# EAGLE design Main (EAGLE 9.1.3)
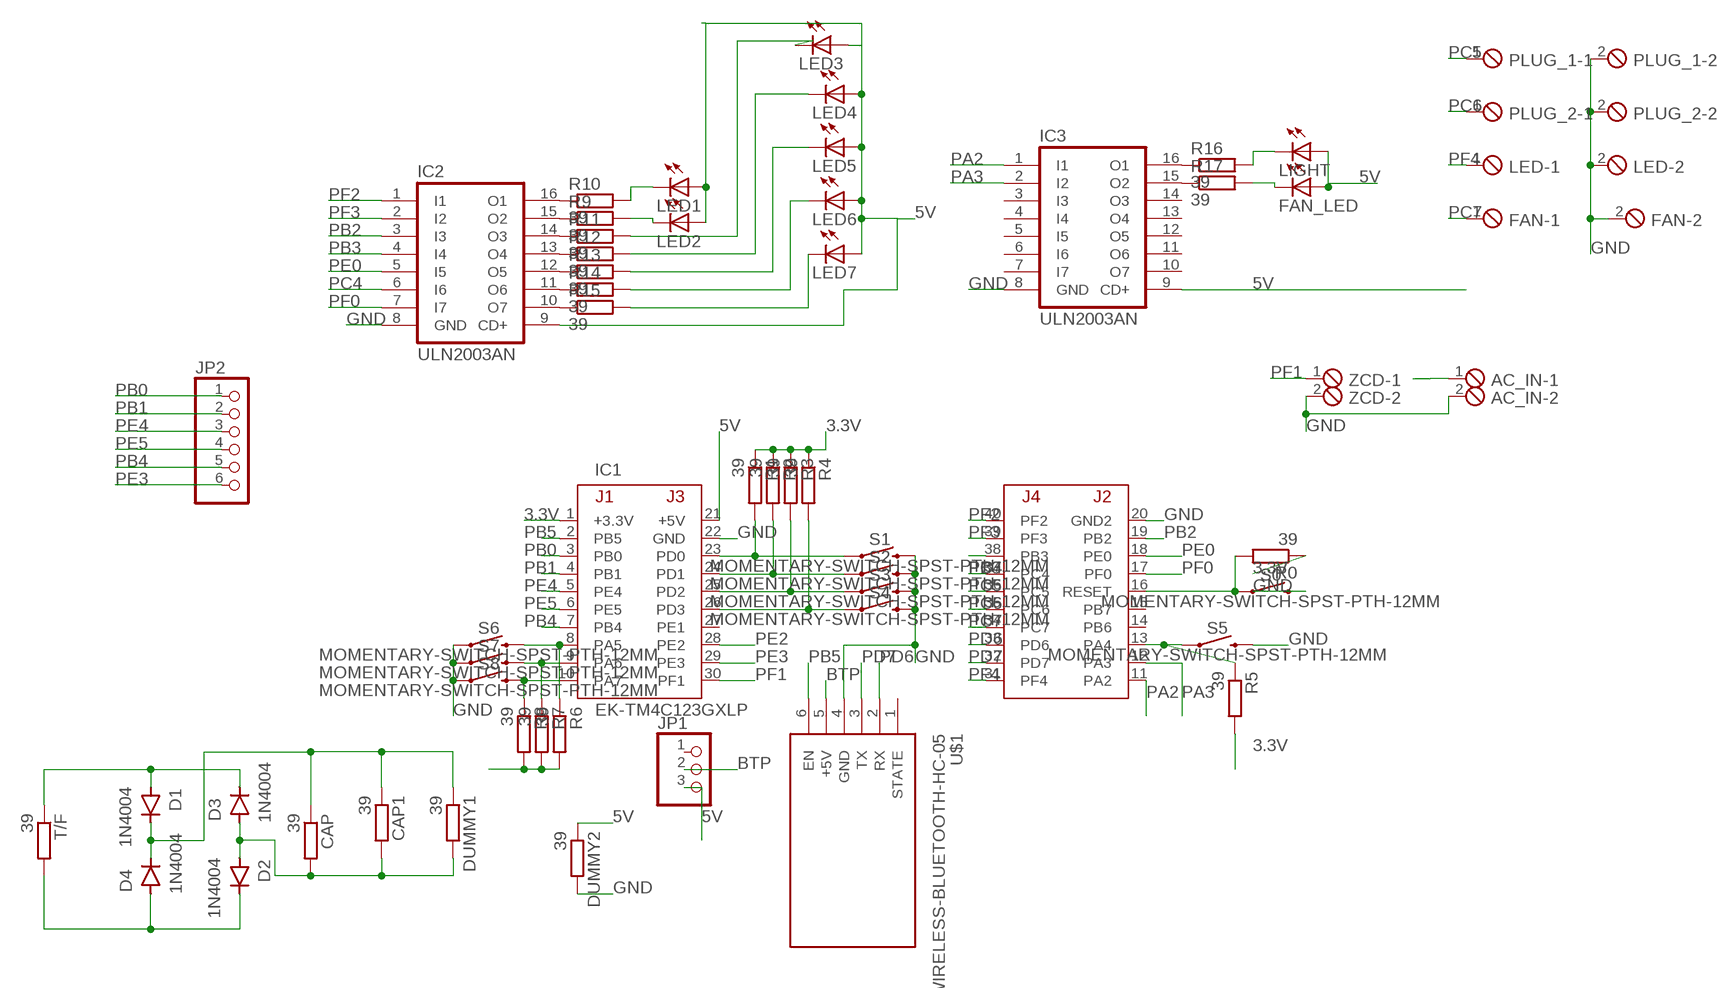
[diagram p0: schematic, sheet 1]

## Parts
AC_IN  MPT2  [2POL254]
CAP  39  R0204/7  [0204/7]
CAP1  39  R0204/7  [0204/7]
D1  1N4004  [DO-41]
D2  1N4004  [DO-41]
D3  1N4004  [DO-41]
D4  1N4004  [DO-41]
DUMMY1  39  R0204/7  [0204/7]
DUMMY2  39  R0204/7  [0204/7]
FAN  MPT2  [2POL254]
FAN_LED  LED3MM  [LED3MM]
IC1  EK-TM4C123GXLP  [TM4C123LAUNCHPAD]
IC2  ULN2003AN  [DIL16]
IC3  ULN2003AN  [DIL16]
JP1  PINHD-1X3CB  [1X03-CLEANBIG]
JP2  PINHD-1X6  [1X06]
LED  MPT2  [2POL254]
LED1  LED3MM  [LED3MM]
LED2  LED3MM  [LED3MM]
LED3  LED3MM  [LED3MM]
LED4  LED3MM  [LED3MM]
LED5  LED3MM  [LED3MM]
LED6  LED3MM  [LED3MM]
LED7  LED3MM  [LED3MM]
LIGHT  LED3MM  [LED3MM]
PLUG_1  MPT2  [2POL254]
PLUG_2  MPT2  [2POL254]
R0  39  R0204/7  [0204/7]
R1  39  R0204/7  [0204/7]
R2  39  R0204/7  [0204/7]
R3  39  R0204/7  [0204/7]
R4  39  R0204/7  [0204/7]
R5  39  R0204/7  [0204/7]
R6  39  R0204/7  [0204/7]
R7  39  R0204/7  [0204/7]
R8  39  R0204/7  [0204/7]
R9  39  R0204/7  [0204/7]
R10  39  R0204/7  [0204/7]
R11  39  R0204/7  [0204/7]
R12  39  R0204/7  [0204/7]
R13  39  R0204/7  [0204/7]
R14  39  R0204/7  [0204/7]
R15  39  R0204/7  [0204/7]
R16  39  R0204/7  [0204/7]
R17  39  R0204/7  [0204/7]
S0  MOMENTARY-SWITCH-SPST-PTH-12MM  [TACTILE_SWITCH_PTH_12MM]
S1  MOMENTARY-SWITCH-SPST-PTH-12MM  [TACTILE_SWITCH_PTH_12MM]
S2  MOMENTARY-SWITCH-SPST-PTH-12MM  [TACTILE_SWITCH_PTH_12MM]
S3  MOMENTARY-SWITCH-SPST-PTH-12MM  [TACTILE_SWITCH_PTH_12MM]
S4  MOMENTARY-SWITCH-SPST-PTH-12MM  [TACTILE_SWITCH_PTH_12MM]
S5  MOMENTARY-SWITCH-SPST-PTH-12MM  [TACTILE_SWITCH_PTH_12MM]
S6  MOMENTARY-SWITCH-SPST-PTH-12MM  [TACTILE_SWITCH_PTH_12MM]
S7  MOMENTARY-SWITCH-SPST-PTH-12MM  [TACTILE_SWITCH_PTH_12MM]
S8  MOMENTARY-SWITCH-SPST-PTH-12MM  [TACTILE_SWITCH_PTH_12MM]
T/F  39  R0204/7  [0204/7]
U$1  WIRELESS-BLUETOOTH-HC-05  [WIRELESS-BLUETOOTH-HC-05]
ZCD  MPT2  [2POL254]

## Nets
3.3V: IC1.1(+3.3V) R0.1 R1.1 R2.1 R3.1 R4.1 R5.2 R6.2 R7.2 R8.2
5V: DUMMY2.1 FAN_LED.A IC1.21(+5V) IC2.9(CD+) IC3.9(CD+) JP1.3 LED1.A LED2.A LED3.A LED4.A LED5.A LED6.A LED7.A LIGHT.A
BTP: JP1.2 U$1.5(+5V)
GND: AC_IN.2 DUMMY2.2 FAN.2 IC1.20(GND2) IC1.22(GND) IC2.8(GND) IC3.8(GND) LED.2 PLUG_1.2 PLUG_2.2 S0.3 S1.3 S2.3 S3.3 S4.3 S5.3 S6.1 S7.1 S8.1 U$1.4(GND) ZCD.2
N$1: IC1.23(PD0) R1.2 S1.1
N$2: IC1.24(PD1) R2.2 S2.1
N$3: IC1.25(PD2) R3.2 S3.1
N$4: IC1.26(PD3) R4.2 S4.1
N$5: IC1.13(PA4) R5.1 S5.1
N$6: IC1.8(PA5) R6.1 S6.3
N$7: IC1.16(RESET) R0.2 S0.1
N$8: IC1.9(PA6) R7.1 S7.3
N$9: IC1.10(PA7) R8.1 S8.3
N$10: IC2.15(O2) R9.1
N$11: IC2.16(O1) R10.1
N$12: IC2.14(O3) R11.1
N$13: IC2.13(O4) R12.1
N$14: D1.A D3.C T/F.1
N$15: IC2.12(O5) R13.1
N$16: IC2.11(O6) R14.1
N$17: IC2.10(O7) R15.1
N$18: IC3.16(O1) R16.1
N$19: LED1.K(C) R10.2
N$20: LED2.K(C) R9.2
N$21: LED3.K(C) R11.2
N$22: LED4.K(C) R12.2
N$23: LED5.K(C) R13.2
N$24: LED6.K(C) R14.2
N$25: LED7.K(C) R15.2
N$26: IC3.15(O2) R17.1
N$28: CAP1.2 CAP.2 D2.A D3.A DUMMY1.2
N$29: CAP1.1 CAP.1 D1.C D4.C DUMMY1.1
N$30: D2.C D4.A T/F.2
N$32: LIGHT.K(C) R16.2
N$33: FAN_LED.K(C) R17.2
PA2: IC1.11(PA2) IC3.1(I1)
PA3: IC1.12(PA3) IC3.2(I2)
PB0: IC1.3(PB0) JP2.1
PB1: IC1.4(PB1) JP2.2
PB2: IC1.19(PB2) IC2.3(I3)
PB3: IC1.38(PB3) IC2.4(I4)
PB4: IC1.7(PB4) JP2.5
PB5: IC1.2(PB5) U$1.6(EN)
PC4: IC1.37(PC4) IC2.6(I6)
PC5: IC1.36(PC5) PLUG_1.1
PC6: IC1.35(PC6) PLUG_2.1
PC7: FAN.1 IC1.34(PC7)
PD6: IC1.33(PD6) U$1.2(RX)
PD7: IC1.32(PD7) U$1.3(TX)
PE0: IC1.18(PE0) IC2.5(I5)
PE2: AC_IN.1 IC1.28(PE2)
PE3: IC1.29(PE3) JP2.6
PE4: IC1.5(PE4) JP2.3
PE5: IC1.6(PE5) JP2.4
PF0: IC1.17(PF0) IC2.7(I7)
PF1: IC1.30(PF1) ZCD.1
PF2: IC1.40(PF2) IC2.1(I1)
PF3: IC1.39(PF3) IC2.2(I2)
PF4: IC1.31(PF4) LED.1
Unconnected: IC1.14(PB6) IC1.15(PB7) IC1.27(PE1) IC3.3(I3) IC3.4(I4) IC3.5(I5) IC3.6(I6) IC3.7(I7) IC3.10(O7) IC3.11(O6) IC3.12(O5) IC3.13(O4) IC3.14(O3) JP1.1 U$1.1(STATE)

## Library data of the parts
AC_IN FAN LED PLUG_1 PLUG_2 ZCD = con-phoenix-254:MPT2: PHOENIX CONNECTOR; OC_FARNELL: unknown; OC_NEWARK: unknown
CAP CAP1 DUMMY1 DUMMY2 R0 R1-R17 T/F = eagle-ltspice:R: RESISTOR, European symbol; SPICEMODEL: NONE; SPICEPREFIX: R
D1-D4 = Diodes:1N4004: DIODE GEN PURP 400V 1A DO41 Manufacturer's datasheet <https://www.mccsemi.com/pdf/Products/1N4001-1N4007(DO-41).pdf>; CREATED_BY: PCBLayout.com; DIGIKEY_PART_NUMBER: 1N4004MSCT-ND; MANUFACTURER: Micro Commercial Co; MPN: 1N4004; PACKAGE: DO-41
FAN_LED LED1-LED7 LIGHT = adafruit:LED: LED OSRAM: - CHIPLED LG R971, LG N971, LY N971, LG Q971, LY Q971, LO R971, LY R971 LH N974, LH R974 LS Q976, LO Q976, LY Q976 LO Q996 - Hyper CHIPLED LW Q18S LB Q993, LB Q99A, LB R99A - SideLED LS A670, LO A670, LY A670, LG A670, LP A670 LB A673, LV A673, LT A673, LW A673 LH A674 LY A675 LS A676, LA A676, LO A676, LY A676, LW A676 LS A679, LY A679, LG A679 - Hyper Micro SIDELED® LS Y876, LA Y876, LO Y876, LY Y876 LT Y87S - SmartLED LW L88C, LW L88S LB L89C, LB L89S, LG L890 LS L89K, LO L89K, LY L89K LS L896, LA L896, LO L896, LY L896 - TOPLED LS T670, LO T670, LY T670, LG T670, LP T670 LSG T670, LSP T670, LSY T670, LOP T670, LYG T670 LG T671, LOG T671, LSG T671 LB T673, LV T673, LT T673, LW T673 LH T674 LS T676, LA T676, LO T676, LY T676, LB T676, LH T676, LSB T676, LW T676 LB T67C, LV T67C, LT T67C, LS T67K, LO T67K, LY T67K, LW E67C LS E67B, LA E67B, LO E67B, LY E67B, LB E67C, LV E67C, LT E67C LW T67C LS T679, LY T679, LG T679 LS T770, LO T770, LY T770, LG T770, LP T770 LB T773, LV T773, LT T773, LW T773 LH T774 LS E675, LA E675, LY E675, LS T675 LS T776, LA T776, LO T776, LY T776, LB T776 LHGB T686 LT T68C, LB T68C - Hyper Mini TOPLED® LB M676 - Mini TOPLED Santana® LG M470 LS M47K, LO M47K, LY M47K Source: http://www.osram.convergy.de/
IC1 = EK-TM4C123GXL:EK-TM4C123GXL: Texas Instruments TM4C123 LaunchPad EK-TM4C123GXL www.ti.com/tool/ek-tm4c123gxl; AVAILABILITY: Unavailable; DESCRIPTION: TM4C123G LaunchPad™ Tiva™ C ARM® Cortex®-M4F MCU 32-Bit Embedded Evaluation Board; MF: Texas Instruments; MP: EK-TM4C123GXL; PACKAGE: None; PRICE: None
IC2 IC3 = uln-udn:ULN2003A: DRIVER ARRAY
JP1 = adafruit:PINHD-1X3: PIN HEADER
JP2 = adafruit:PINHD-1X6: PIN HEADER
S0 S1-S8 = SparkFun-Switches:MOMENTARY-SWITCH-SPST: Momentary Switch (Pushbutton) - SPST Normally-open (NO) SPST momentary switches (buttons, pushbuttons). Variants PTH-12MM - 12mm square, through-hole Momentary Pushbutton Switch - 12mm Square <https://www.sparkfun.com/products/9190> (COM-09190) PTH-6.0MM, PTH-6.0MM-KIT - 6.0mm square, through-hole Mini Pushbutton Switch <https://www.sparkfun.com/products/97> (COM-00097) KIT package intended for soldering kit's - only one side of pads' copper is exposed. PTH-RIGHT-ANGLE-KIT - Right-angle, through-hole Right Angle Tactile Button <https://www.sparkfun.com/products/10791> - Used on SparkFun BigTime Watch Kit <https://www.sparkfun.com/products/11734> SMD-12MM - 12mm square, surface-mount Tactile Button - SMD (12mm) <https://www.sparkfun.com/products/12993> (COM-12993) Used on SparkFun PicoBoard <https://www.sparkfun.com/products/11888> SMD-4.5MM - 4.5mm Square Trackball Switch Used on SparkFun Blackberry Trackballer Breakout <https://www.sparkfun.com/products/13169> SMD-4.6MMX2.8MM - 4.60mm x 2.80mm, surface mount Used on SparkFun SAMD21 Mini Breakout <https://www.sparkfun.com/products/13664> SMD-5.2MM, SMD-5.2-REDUNDANT - 5.2mm square, surface-mount Mini Pushbutton Switch - SMD <https://www.sparkfun.com/products/8720> (COM-08720) Used on Arduino Pro Mini <https://www.sparkfun.com/products/11114> REDUNDANT package connects both switch circuits together SMD-6.0X3.5MM - 6.0 x 3.5mm, surface mount Momentary Reset Switch SMD <https://www.sparkfun.com/products/8229> (COM-08229) SMD-6.2MM-TALL - 6.2mm square, surface mount Tactile Button - SMD (6mm) <https://www.sparkfun.com/products/12992> Used on SparkFun Digital Sandbox <https://www.sparkfun.com/products/12651> SMD-RIGHT-ANGLE - Right-angle, surface mount Used on SparkFun Block for Intel® Edison - Arduino <https://www.sparkfun.com/products/13036>; PROD_ID: SWCH-09185; SF_SKU: COM-09190
U$1 = diy-modules:WIRELESS-BLUETOOTH-HC-05: Bluetooth Transceiver Module based on HC-05 board Tutorial is available here: https://arduino-info.wikispaces.com/BlueTooth-HC05-HC06-Modules-How-To Click here to find device on ebay.com <http://www.ebay.com/sch/hc-05+module+rs232>

## Board
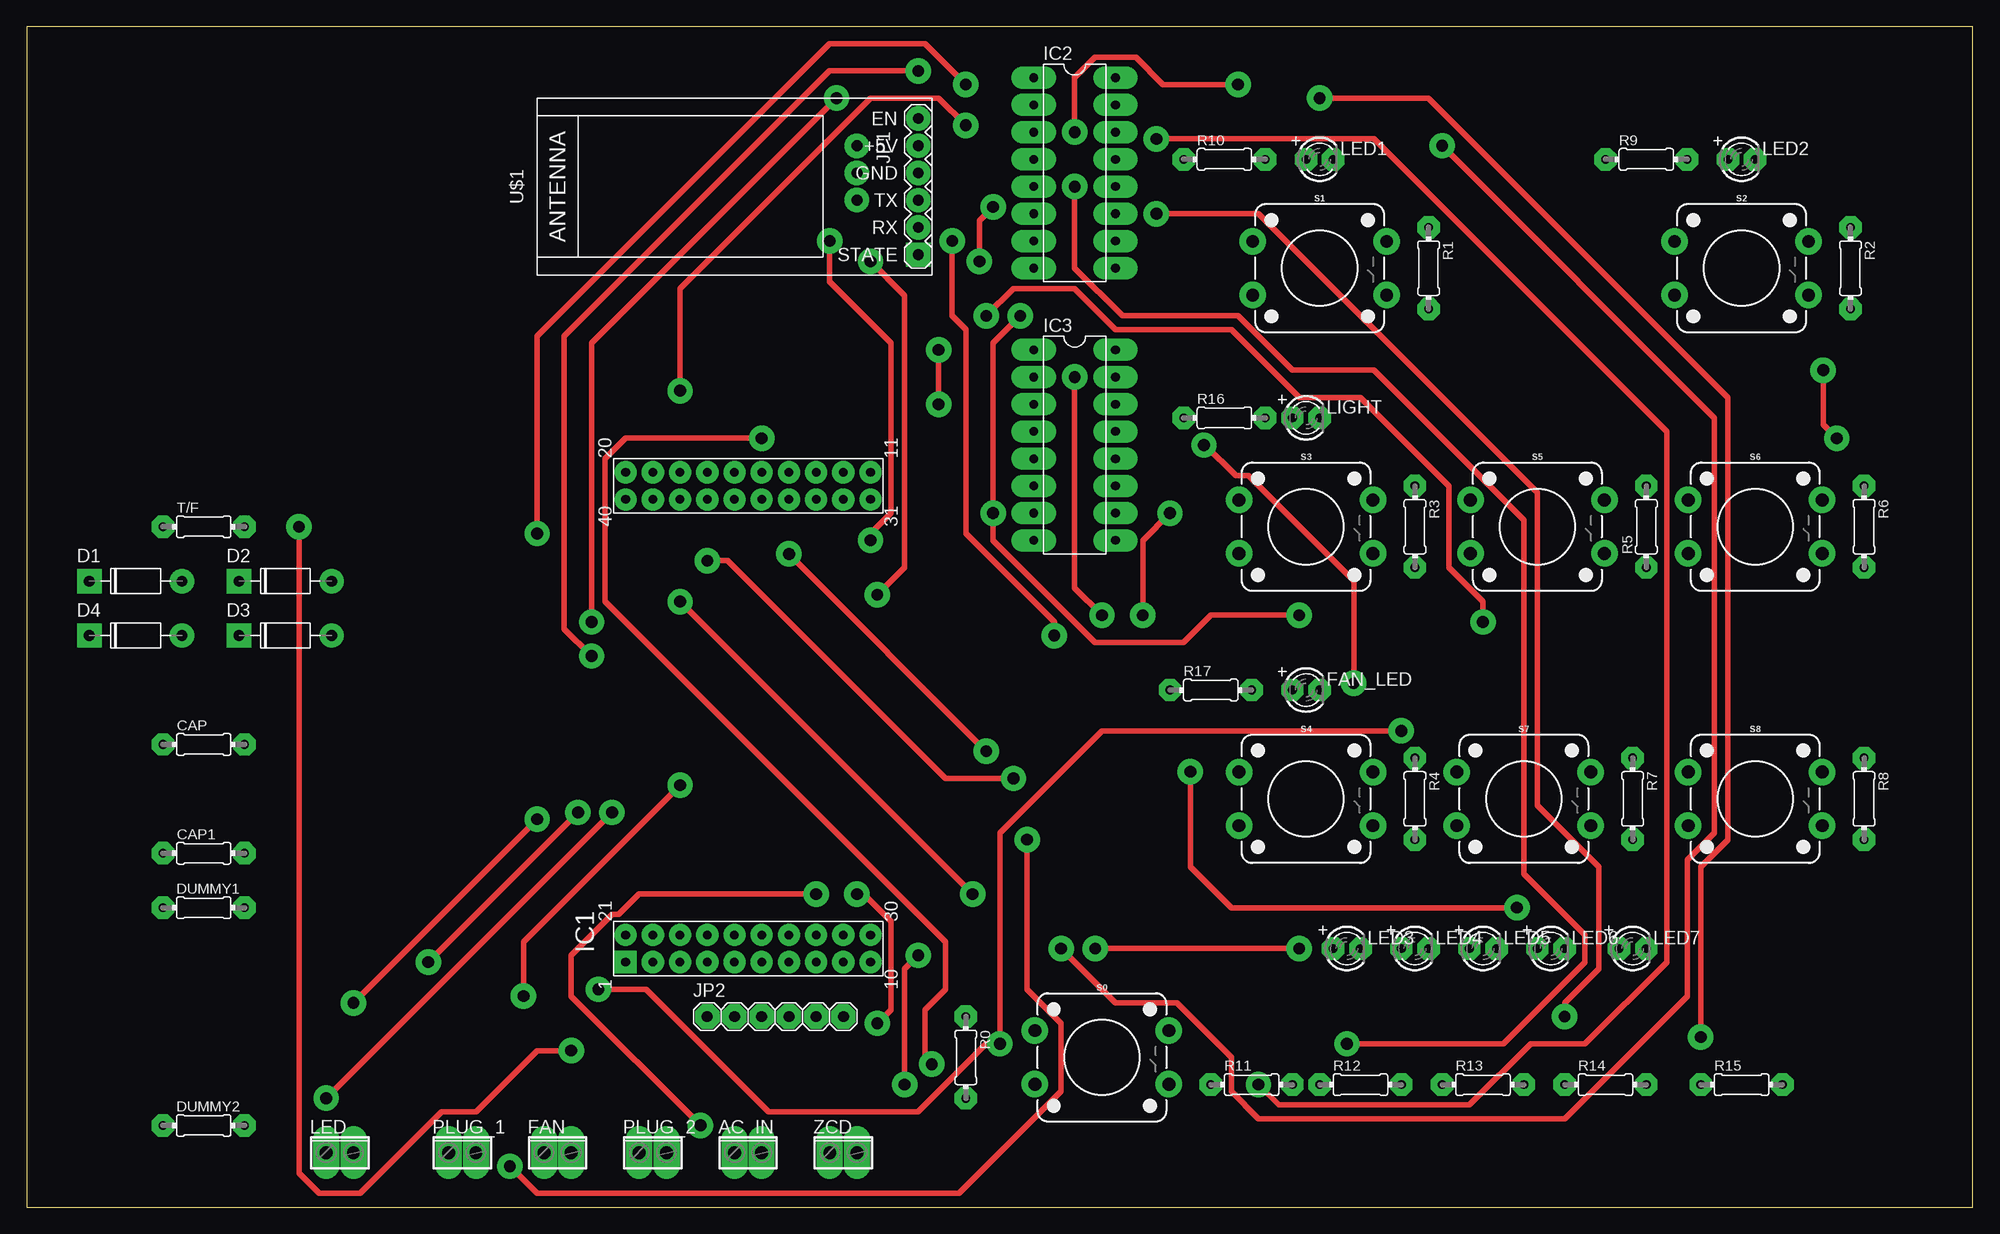
[diagram p1: board, top side]
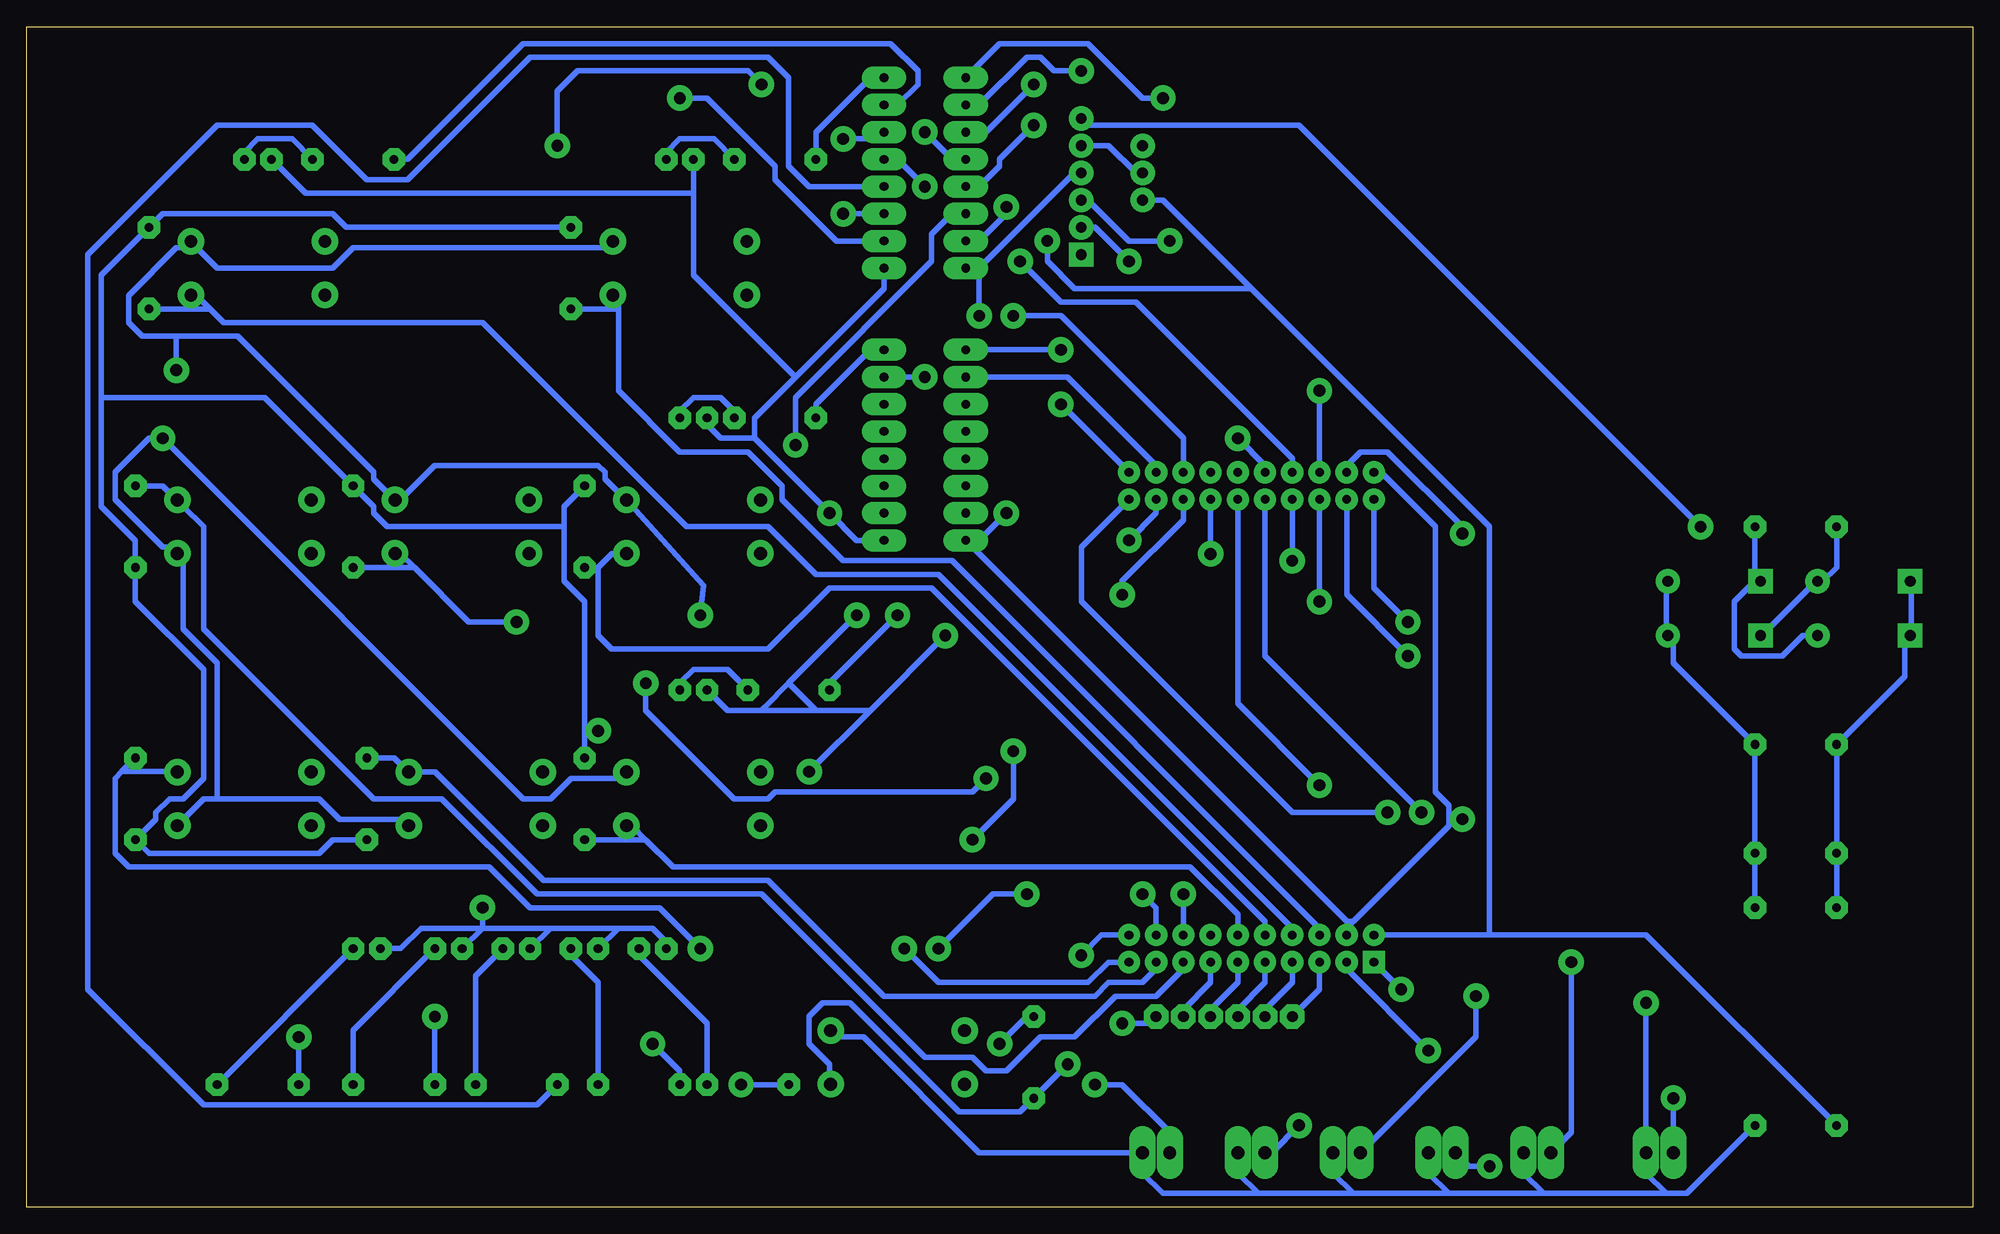
[diagram p2: board, bottom side, seen from below]

Size 181.59 x 110.16 mm. Coordinates in mm from the lower left corner, seen from the top.
Outline: 0,0 181.59,0 181.59,110.16 0,110.16 0,0
Copper layers (1*16): Top 0.035mm / dielectric 1.5mm / Bottom 0.035mm
Design rules "default *": minimum track width 20mil, minimum drill 1.1mm, track to track 20mil, track to pad 20mil, pad to pad 20mil, via to via 20mil, smd to smd 6mil, copper to edge 40mil, drill to drill 6mil, minimum pad ring 25mil, minimum via ring 25mil, stop-mask expansion 4mil, vias tented up to drill 0mil, thermal gap 10mil

### Footprints (pad centres in the part's own frame; a part is rotated, then mirrored left to right if it is on the bottom)
2POL254 = drill 1.2 long: 1 -1.27,0; 2 1.27,0
0204/7 = drill 0.813 octagon: 1 -3.81,0; 2 3.81,0
DO-41 = drill 1: A 4.325,0 | drill 1 square: C -4.325,0
LED3MM = drill 0.813 pad 1.676 octagon: A -1.27,0; K 1.27,0
TM4C123LAUNCHPAD = drill 0.8 square: 1 -22.86,12.7 | drill 0.8: 2 -22.86,10.16; 3 -22.86,7.62; 4 -22.86,5.08; 5 -22.86,2.54; 6 -22.86,0; 7 -22.86,-2.54; 8 -22.86,-5.08; 9 -22.86,-7.62; 10 -22.86,-10.16; 11 22.86,-10.16; 12 22.86,-7.62; 13 22.86,-5.08; 14 22.86,-2.54; 15 22.86,0; 16 22.86,2.54; 17 22.86,5.08; 18 22.86,7.62; 19 22.86,10.16; 20 22.86,12.7; 21 -20.32,12.7; 22 -20.32,10.16; 23 -20.32,7.62; 24 -20.32,5.08; 25 -20.32,2.54; 26 -20.32,0; 27 -20.32,-2.54; 28 -20.32,-5.08; 29 -20.32,-7.62; 30 -20.32,-10.16; 31 20.32,-10.16; 32 20.32,-7.62; 33 20.32,-5.08; 34 20.32,-2.54; 35 20.32,0; 36 20.32,2.54; 37 20.32,5.08; 38 20.32,7.62; 39 20.32,10.16; 40 20.32,12.7
DIL16 = drill 0.813 long: 1 -8.89,-3.81; 2 -6.35,-3.81; 3 -3.81,-3.81; 4 -1.27,-3.81; 5 1.27,-3.81; 6 3.81,-3.81; 7 6.35,-3.81; 8 8.89,-3.81; 9 8.89,3.81; 10 6.35,3.81; 11 3.81,3.81; 12 1.27,3.81; 13 -1.27,3.81; 14 -3.81,3.81; 15 -6.35,3.81; 16 -8.89,3.81
1X03-CLEANBIG = drill 1.016 pad 1.676: 1 -2.54,0; 2 0,0; 3 2.54,0
1X06 = drill 1.016 octagon: 1 -6.35,0; 2 -3.81,0; 3 -1.27,0; 4 1.27,0; 5 3.81,0; 6 6.35,0
TACTILE_SWITCH_PTH_12MM = drill 1.2 pad 2.159: 1 6.25,-2.5; 2 -6.25,-2.5; 3 6.25,2.5; 4 -6.25,2.5
WIRELESS-BLUETOOTH-HC-05 = drill 1 square: 1 -6.35,-17.145 | drill 1: 2 -3.81,-17.145; 3 -1.27,-17.145; 4 1.27,-17.145; 5 3.81,-17.145; 6 6.35,-17.145

### Placement (x,y rotation side)
AC_IN  67.31,5.08 0 top
CAP  16.51,43.18 0 top
CAP1  16.51,33.02 0 top
D1  10.16,58.42 0 top
D2  24.13,58.42 0 top
D3  24.13,53.34 0 top
D4  10.16,53.34 0 top
DUMMY1  16.51,27.94 0 top
DUMMY2  16.51,7.62 0 top
FAN  49.53,5.08 0 top
FAN_LED  119.38,48.26 0 top
IC1  68.58,45.72 90 top
IC2  97.79,96.52 270 top
IC3  97.79,71.12 270 top
JP1  77.47,96.52 270 top
JP2  69.85,17.78 0 top
LED  29.21,5.08 0 top
LED1  120.65,97.79 0 top
LED2  160.02,97.79 0 top
LED3  123.19,24.13 0 top
LED4  129.54,24.13 0 top
LED5  135.89,24.13 0 top
LED6  142.24,24.13 0 top
LED7  149.86,24.13 0 top
LIGHT  119.38,73.66 0 top
PLUG_1  40.64,5.08 0 top
PLUG_2  58.42,5.08 0 top
R0  87.63,13.97 270 top
R1  130.81,87.63 270 top
R2  170.18,87.63 270 top
R3  129.54,63.5 270 top
R4  129.54,38.1 270 top
R5  151.13,63.5 90 top
R6  171.45,63.5 270 top
R7  149.86,38.1 270 top
R8  171.45,38.1 270 top
R9  151.13,97.79 0 top
R10  111.76,97.79 0 top
R11  114.3,11.43 0 top
R12  124.46,11.43 0 top
R13  135.89,11.43 0 top
R14  147.32,11.43 0 top
R15  160.02,11.43 0 top
R16  111.76,73.66 0 top
R17  110.49,48.26 0 top
S0  100.33,13.97 0 top
S1  120.65,87.63 0 top
S2  160.02,87.63 0 top
S3  119.38,63.5 0 top
S4  119.38,38.1 0 top
S5  140.97,63.5 0 top
S6  161.29,63.5 0 top
S7  139.7,38.1 0 top
S8  161.29,38.1 0 top
T/F  16.51,63.5 0 top
U$1  66.04,95.25 90 top
ZCD  76.2,5.08 0 top

### Tracks (layer width: path | path; a pad name or v marks a point on that pad's centre or on a via)
3.3V  (via drill 1.1)
  Top 0.508: v53.34,20.32 57.78,20.32 69.22,8.89 83.19,8.89 89.53,15.24 v90.81,15.24 90.81,34.92 100.33,44.45 v128.27,44.45
  Bottom 0.508: R7.2 153.03,34.29 154.31,33.02 170.18,33.02 R8.2 169.55,36.2 169.55,36.83 168.28,38.1 167,38.1 165.1,40 165.1,50.16 171.45,56.52 R6.2 171.45,62.23 174.62,65.41 174.62,71.75 174.62,75.56 | R1.1 151.76,91.44 153.03,92.71 168.91,92.71 R2.1 174.62,87 174.62,75.56 | v53.34,20.32 IC1.1 | v90.81,15.24 88.27,17.78 R0.1 | 129.54,44.45 129.54,56.52 131.44,58.42 131.44,63.5 | 129.54,44.45 R4.1 | 131.44,63.5 131.44,65.41 R3.1 | 131.44,63.5 147.95,63.5 149.22,64.77 149.22,65.41 R5.2 159.38,75.56 174.62,75.56 | 129.54,44.45 v128.27,44.45
5V  (via drill 1.1)
  Top 0.508: v104.14,55.24 104.14,62.23 v106.68,64.77 | v139.06,27.94 112.39,27.94 108.59,31.75 v108.59,40.64 | v95.89,53.34 95.89,54.61 87.63,62.86 87.63,81.91 86.36,83.19 v86.36,90.17
  Bottom 0.508: LED3.A 121.92,24.77 123.19,26.03 126.37,26.03 | LED4.A 126.37,26.03 | 132.72,26.03 LED5.A | 126.37,26.03 132.72,26.03 | 139.06,26.03 LED6.A | 132.72,26.03 139.06,26.03 | LED7.A 146.69,24.13 144.78,26.03 139.06,26.03 | IC3.9 104.14,62.23 v106.68,64.77 113.66,71.75 | 113.66,71.75 116.84,71.75 118.11,73.02 LIGHT.A | FAN_LED.A 116.2,46.35 114.94,46.35 | 102.87,46.35 114.94,46.35 | v104.14,55.24 110.49,48.89 | 110.49,48.89 112.71,46.67 | 112.71,46.67 113.03,46.35 114.94,46.35 | IC2.9 101.6,85.72 109.86,77.47 | 109.86,77.47 113.66,73.66 113.66,71.75 | 119.38,94.61 119.38,87 109.86,77.47 | 119.38,94.61 LED1.A | LED2.A 155.57,94.61 119.38,94.61 | v139.06,27.94 139.06,26.03 | 102.87,46.35 v108.59,40.64 | 45.09,25.4 30.48,25.4 DUMMY2.1 | 45.09,25.4 IC1.21 | JP1.3 75.56,93.98 67.31,85.72 | 67.31,85.72 45.09,63.5 45.09,25.4 | 110.49,48.89 107.95,46.35 102.87,46.35 | v95.89,53.34 102.87,46.35 | v86.36,90.17 86.36,88.27 83.82,85.72 67.31,85.72 | 112.71,46.67
BTP
  Bottom 0.508: U$1.5 80.64,99.06 78.11,96.52 JP1.2
GND  (via drill 1.1)
  Top 0.508: v92.71,83.19 90.17,80.64 v90.17,64.77 90.17,62.23 99.69,52.7 107.95,52.7 110.49,55.24 v118.75,55.24 | v47.62,36.2 v30.48,19.05 | v167.64,78.11 167.64,73.02 v168.91,71.75
  Bottom 0.508: S1.3 127,89.53 151.13,89.53 153.03,87.63 163.83,87.63 165.74,89.53 S2.3 166.37,89.53 167.64,89.53 172.08,85.09 172.08,82.55 170.81,81.28 167.64,81.28 | 167.64,81.28 161.93,81.28 149.22,68.58 149.22,67.95 147.32,66.04 S5.3 146.69,66.04 143.51,69.22 128.27,69.22 127.63,68.58 127.63,67.95 125.73,66.04 S3.3 118.45,58.02 v118.75,55.24 | 163.83,38.1 165.1,38.1 167,36.2 S8.1 | 163.83,38.1 154.31,38.1 152.4,36.2 146.05,36.2 S7.1 | S4.3 125.73,40 130.81,40 132.72,38.1 135.25,38.1 v168.91,71.75 170.18,71.75 173.36,68.58 173.36,66.04 168.91,61.59 167.64,61.59 S6.1 167,60.96 167,53.98 163.83,50.8 163.83,38.1 | v167.64,78.11 167.64,81.28 | DUMMY2.2 26.67,1.27 28.58,1.27 | 28.58,1.27 30.48,3.17 LED.2 v30.48,19.05 | PLUG_1.2 41.91,3.17 40.01,1.27 | 28.58,1.27 40.01,1.27 | FAN.2 50.8,3.17 48.89,1.27 | 40.01,1.27 48.89,1.27 | PLUG_2.2 59.69,3.17 57.78,1.27 | 48.89,1.27 57.78,1.27 | AC_IN.2 68.58,3.17 66.67,1.27 | 57.78,1.27 66.67,1.27 | 66.67,1.27 75.56,1.27 77.47,3.17 ZCD.2 92.71,5.08 103.5,15.88 106.05,15.88 S0.3 | 92.71,87.63 83.82,96.52 U$1.4 | IC1.20 55.25,68.58 50.16,63.5 50.16,38.73 48.89,37.46 48.89,36.2 | 48.89,36.2 48.89,35.56 57.78,26.67 | 57.78,26.67 58.42,26.03 IC1.22 | 93.34,61.59 58.42,26.67 57.78,26.67 | v92.71,83.19 92.71,87.63 | 93.34,61.59 v90.17,64.77 | 92.71,87.63 IC2.8 | 93.34,61.59 IC3.8 | 48.89,36.2 v47.62,36.2
N$1
  Bottom 0.508: IC1.23 60.96,26.03 95.25,60.32 105.41,60.32 111.12,66.04 111.12,67.31 114.3,70.48 120.65,70.48 126.37,76.2 126.37,83.82 | 126.37,83.82 126.37,85.09 S1.1 | 126.37,83.82 R1.2
N$2
  Bottom 0.508: IC1.24 63.5,26.03 96.52,59.05 107.95,59.05 112.39,63.5 120.02,63.5 139.06,82.55 163.19,82.55 164.47,83.82 | 164.47,83.82 165.74,85.09 S2.1 | 164.47,83.82 R2.2
N$3
  Bottom 0.508: IC1.25 66.04,26.67 97.16,57.78 106.68,57.78 112.39,52.07 127,52.07 128.27,53.34 128.27,59.69 | 125.09,60.96 S3.1 126.96,61 128.27,59.69 | 128.27,59.69 R3.2
N$4
  Bottom 0.508: IC1.26 68.58,27.3 73.03,31.75 121.28,31.75 123.83,34.29 | 123.83,34.29 125.09,35.56 S4.1 | 123.83,34.29 R4.2
N$5  (via drill 1.1)
  Top 0.508: v89.53,83.19 92.08,85.72 97.79,85.72 101.6,81.91 112.39,81.91 118.75,75.56 124.46,75.56 132.72,67.31 132.72,59.69 135.89,56.52 v135.89,54.61
  Bottom 0.508: IC1.13 73.66,71.75 85.09,83.19 v89.53,83.19 | v135.89,54.61 140.34,54.61 145.41,59.69 | 145.41,59.69 146.69,60.96 S5.1 | 145.41,59.69 R5.1
N$6
  Bottom 0.508: IC1.8 73.66,22.23 76.2,19.69 80.01,19.69 83.82,15.88 87,15.88 90.17,12.7 92.08,12.7 93.34,13.97 97.79,13.97 113.03,29.21 133.99,29.21 142.88,38.1 149.22,38.1 165.1,53.98 165.1,63.5 167,65.41 S6.3 167.64,66.04 168.91,67.31 R6.1
N$7  (via drill 1.1)
  Top 0.508: v68.58,71.75 55.88,71.75 53.98,69.85 53.98,56.52 85.72,24.77 85.72,20.32 83.82,18.41 83.82,13.97 v84.45,13.34
  Bottom 0.508: IC1.16 66.04,69.22 v68.58,71.75 | v84.45,13.34 R0.2 88.9,8.89 94.61,8.89 104.78,19.05 107.31,19.05 108.59,17.78 108.59,15.24 106.68,13.34 106.68,12.07 S0.1
N$8
  Bottom 0.508: IC1.9 76.2,22.23 77.47,20.95 80.64,20.95 81.91,19.69 101.6,19.69 112.39,30.48 133.35,30.48 143.47,40.6 S7.3 146.05,40.64 147.32,41.91 R7.1
N$9  (via drill 1.1)
  Top 0.508: v118.75,24.13 v99.69,24.13
  Bottom 0.508: IC1.10 80.64,22.86 82.55,20.95 96.52,20.95 v99.69,24.13 | v118.75,24.13 122.56,27.94 134.62,27.94 138.43,31.75 172.08,31.75 173.36,33.02 173.36,40 172.72,40.64 | R8.1 172.72,40.64 | 172.72,40.64 167.64,40.64 S8.3
N$10
  Bottom 0.508: R9.1 146.05,97.79 135.25,108.58 100.97,108.58 98.42,106.05 98.42,104.77 100.33,102.87 IC2.15
N$11
  Bottom 0.508: R10.1 107.95,100.33 102.87,105.41 IC2.16
N$12  (via drill 1.1)
  Top 0.508: v114.94,11.43 116.84,9.53 134.62,9.53 140.34,15.24 145.41,15.24 153.03,22.86 153.03,72.39 125.73,99.69 v105.41,99.69
  Bottom 0.508: v114.94,11.43 R11.1 | v105.41,99.69 102.23,99.69 IC2.14
N$13  (via drill 1.1)
  Top 0.508: v97.79,95.25 97.79,87.63 102.23,83.19 113.03,83.19 118.11,78.11 125.73,78.11 139.7,64.14 139.7,31.12 145.41,25.4 145.41,22.86 137.8,15.24 v123.19,15.24
  Bottom 0.508: IC2.13 100.33,97.79 v97.79,95.25 | v123.19,15.24 120.65,12.7 R12.1
N$14
  Bottom 0.508: T/F.1 12.7,59.69 13.97,58.42 D1.A 14.61,58.42 19.69,53.34 D3.C
N$15
  Bottom 0.508: IC2.12 108.59,95.25 110.49,97.16 110.49,105.41 112.39,107.31 134.62,107.31 146.05,95.89 149.86,95.89 154.94,100.97 163.83,100.97 175.89,88.9 175.89,20.32 165.1,9.53 133.99,9.53 R13.1
N$16  (via drill 1.1)
  Top 0.508: v143.51,17.78 143.51,19.05 146.69,22.23 146.69,31.75 140.97,37.46 140.97,66.67 114.94,92.71 v105.41,92.71
  Bottom 0.508: v143.51,17.78 R14.1 | IC2.11 v105.41,92.71
N$17  (via drill 1.1)
  Top 0.508: v156.21,15.88 156.21,31.75 158.75,34.29 158.75,75.56 130.81,103.5 v120.65,103.5
  Bottom 0.508: v156.21,15.88 R15.1 | v120.65,103.5 118.11,103.5 111.76,97.16 111.76,95.89 106.05,90.17 IC2.10
N$18
  Bottom 0.508: R16.1 107.95,74.93 102.87,80.01 IC3.16
N$19
  Bottom 0.508: R10.2 117.47,99.69 120.65,99.69 121.92,98.42 LED1.K
N$20
  Bottom 0.508: R9.2 156.84,99.69 160.02,99.69 161.29,98.42 LED2.K
N$21
  Bottom 0.508: R11.2 118.11,17.14 124.46,23.49 LED3.K
N$22
  Bottom 0.508: R12.2 128.27,20.95 130.81,23.49 LED4.K
N$23
  Bottom 0.508: R13.2 139.7,21.59 LED5.K
N$24
  Bottom 0.508: R14.2 151.13,16.51 LED6.K
N$25
  Bottom 0.508: R15.2 LED7.K
N$26  (via drill 1.1)
  Top 0.508: v97.79,77.47 97.79,57.78 v100.33,55.24
  Bottom 0.508: v97.79,77.47 IC3.15 | v100.33,55.24 106.68,48.89 R17.1
N$28
  Bottom 0.508: D2.A 28.58,58.42 28.58,53.34 D3.A 27.94,53.34 27.94,50.8 CAP.2 CAP1.2 DUMMY1.2
N$29
  Bottom 0.508: D1.C 5.72,58.42 5.72,53.34 D4.C 6.35,53.34 6.35,49.53 CAP.1 CAP1.1 DUMMY1.1
N$30
  Bottom 0.508: 20.32,58.42 T/F.2 | D4.A 15.88,53.34 17.78,51.43 21.59,51.43 22.22,52.07 22.22,56.52 20.32,58.42 | 20.32,58.42 D2.C
N$32
  Bottom 0.508: R16.2 115.57,74.3 116.84,75.56 119.38,75.56 120.65,74.3 LIGHT.K
N$33
  Bottom 0.508: R17.2 116.2,50.16 119.38,50.16 120.65,48.89 FAN_LED.K
PA2  (via drill 1.1)
  Top 0.508: v85.09,80.01 v85.09,74.93
  Bottom 0.508: v85.09,74.93 IC1.11 | IC3.1 v85.09,80.01
PA3
  Bottom 0.508: IC1.12 76.2,69.22 84.45,77.47 IC3.2
PB0
  Bottom 0.508: IC1.3 60.96,20.32 JP2.1
PB1
  Bottom 0.508: IC1.4 63.5,20.95 66.04,18.41 JP2.2
PB2  (via drill 1.1)
  Top 0.508: v47.62,62.86 47.62,81.28 74.93,108.58 83.82,108.58 v87.63,104.77
  Bottom 0.508: IC1.19 58.42,69.22 57.15,70.48 54.61,70.48 47.62,63.5 v47.62,62.86 | v87.63,104.77 92.08,100.33 IC2.3
PB3  (via drill 1.1)
  Top 0.508: v88.27,29.21 v60.96,56.52 | v96.52,24.13 101.6,19.05 107.31,19.05 112.39,13.97 112.39,10.79 114.94,8.25 143.51,8.25 154.94,19.69 154.94,32.38 157.48,34.92 157.48,73.66 v132.08,99.06 | v113.03,104.77 106.05,104.77 103.5,107.31 99.69,107.31 97.79,105.41 v97.79,100.33
  Bottom 0.508: v60.96,56.52 IC1.38 | v88.27,29.21 91.44,29.21 v96.52,24.13 | v132.08,99.06 132.08,104.14 130.18,106.05 114.3,106.05 v113.03,104.77 | v97.79,100.33 95.25,97.79 IC2.4
PB4
  Bottom 0.508: IC1.7 71.12,20.95 73.66,18.41 JP2.5
PB5  (via drill 1.1)
  Top 0.508: v50.8,14.61 47.62,14.61 41.91,8.89 38.73,8.89 31.12,1.27 27.3,1.27 25.4,3.17 v25.4,63.5
  Bottom 0.508: IC1.2 58.42,22.23 v50.8,14.61 | v25.4,63.5 62.86,100.97 82.55,100.97 U$1.6
PC4  (via drill 1.1)
  Top 0.508: v63.5,60.32 65.41,60.32 85.72,40 v92.08,40 | v123.83,48.89 123.83,58.42 113.98,68.26 112.84,68.26 109.92,71.18 v109.86,71.12
  Bottom 0.508: v63.5,60.32 IC1.37 | v123.83,48.89 123.83,46.35 115.57,38.1 112.39,38.1 111.76,38.73 93.34,38.73 v92.08,40 | v109.86,71.12 109.86,75.56 97.16,88.27 97.16,90.8 95.25,92.71 IC2.6
PC5  (via drill 1.1)
  Top 0.508: v37.46,22.86 v51.44,36.83
  Bottom 0.508: IC1.36 66.04,51.43 v51.44,36.83 | v37.46,22.86 37.46,6.99 PLUG_1.1
PC6  (via drill 1.1)
  Top 0.508: v60.96,39.37 46.35,24.77 v46.35,19.69
  Bottom 0.508: IC1.35 68.58,46.99 v60.96,39.37 | v46.35,19.69 46.35,15.88 PLUG_2.1
PC7  (via drill 1.1)
  Top 0.508: v89.53,42.55 v71.12,60.96 | v93.34,34.29 93.34,20.32 96.52,17.14 96.52,10.79 87,1.27 47.62,1.27 v45.09,3.81
  Bottom 0.508: v71.12,60.96 IC1.34 | v89.53,42.55 89.53,38.1 v93.34,34.29 | v45.09,3.81 46.99,3.81 FAN.1
PD6  (via drill 1.1)
  Top 0.508: v79.38,57.15 81.91,59.69 81.91,85.09 v78.74,88.27
  Bottom 0.508: IC1.33 73.66,64.14 79.38,58.42 v79.38,57.15 | v78.74,88.27 81.91,91.44 U$1.2
PD7  (via drill 1.1)
  Top 0.508: v78.74,62.23 78.74,62.86 80.64,64.77 80.64,80.64 74.93,86.36 v74.93,90.17
  Bottom 0.508: IC1.32 76.2,64.77 v78.74,62.23 | v74.93,90.17 78.74,90.17 82.55,93.98 U$1.3
PE0  (via drill 1.1)
  Top 0.508: v60.96,76.2 60.96,85.72 78.74,103.5 85.09,103.5 v87.63,100.97
  Bottom 0.508: v60.96,76.2 IC1.18 | v87.63,100.97 90.81,97.79 90.81,97.16 92.71,95.25 IC2.5
PE2  (via drill 1.1)
  Top 0.508: v73.66,29.21 57.15,29.21 55.25,27.3 54.61,27.3 50.8,23.49 50.8,19.69 v62.86,7.62
  Bottom 0.508: v73.66,29.21 IC1.28 | v62.86,7.62 65.41,5.08 AC_IN.1
PE3  (via drill 1.1)
  Top 0.508: v77.47,29.21 78.11,29.21 80.64,26.67 80.64,18.41 v79.38,17.14
  Bottom 0.508: IC1.29 76.2,27.94 v77.47,29.21 | v79.38,17.14 76.83,17.14 JP2.6
PE4
  Bottom 0.508: IC1.5 66.04,20.95 68.58,18.41 JP2.3
PE5
  Bottom 0.508: IC1.6 68.58,20.95 71.12,18.41 JP2.4
PF0  (via drill 1.1)
  Top 0.508: v88.9,88.27 88.9,92.08 v90.17,93.34
  Bottom 0.508: IC1.17 63.5,69.85 78.11,84.45 85.09,84.45 v88.9,88.27 | v90.17,93.34 90.17,92.71 92.71,90.17 IC2.7
PF1  (via drill 1.1)
  Top 0.508: v81.91,11.43 81.91,22.23 v83.19,23.49
  Bottom 0.508: IC1.30 81.28,25.4 v83.19,23.49 | v81.91,11.43 79.38,11.43 74.93,6.99 ZCD.1
PF2  (via drill 1.1)
  Top 0.508: v52.7,54.61 52.7,80.64 v75.56,103.5
  Bottom 0.508: IC1.40 55.88,57.78 v52.7,54.61 | v75.56,103.5 77.47,103.5 82.55,108.58 90.81,108.58 IC2.1
PF3  (via drill 1.1)
  Top 0.508: v52.7,51.43 50.16,53.98 50.16,81.28 74.93,106.05 v83.19,106.05
  Bottom 0.508: IC1.39 58.42,57.15 v52.7,51.43 | v83.19,106.05 85.72,106.05 87,107.31 88.27,107.31 92.71,102.87 IC2.2
PF4  (via drill 1.1)
  Top 0.508: v27.94,10.16 v54.61,36.83
  Bottom 0.508: IC1.31 83.19,61.59 83.19,56.52 63.5,36.83 v54.61,36.83 | LED.1 v27.94,10.16